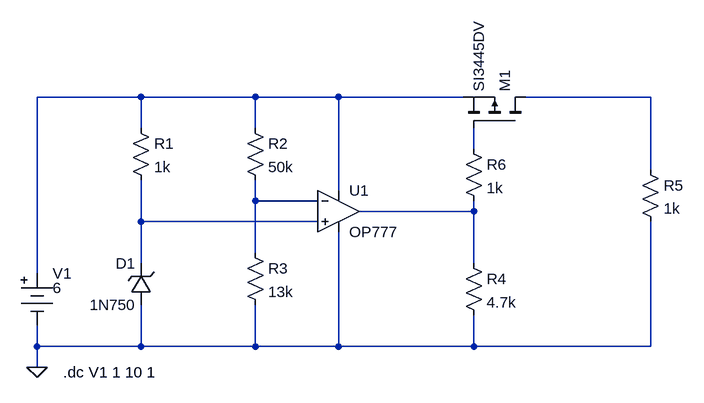
[diagram p0: schematic uvlo.asc]
uvlo.asc, the LTspice schematic file:
Version 4
SHEET 1 1220 680
WIRE 384 80 224 80
WIRE 560 80 384 80
WIRE 688 80 560 80
WIRE 880 80 688 80
WIRE 1168 80 976 80
WIRE 384 128 384 80
WIRE 560 128 560 80
WIRE 896 160 896 128
WIRE 1168 192 1168 80
WIRE 688 224 688 80
WIRE 560 240 560 208
WIRE 656 240 560 240
WIRE 896 256 896 240
WIRE 896 256 720 256
WIRE 384 272 384 208
WIRE 656 272 384 272
WIRE 560 320 560 240
WIRE 384 336 384 272
WIRE 896 336 896 256
WIRE 224 352 224 80
WIRE 224 464 224 432
WIRE 384 464 384 400
WIRE 384 464 224 464
WIRE 560 464 560 400
WIRE 560 464 384 464
WIRE 688 464 688 288
WIRE 688 464 560 464
WIRE 896 464 896 416
WIRE 896 464 688 464
WIRE 1168 464 1168 272
WIRE 1168 464 896 464
WIRE 224 496 224 464
FLAG 224 496 0
SYMBOL Misc/battery 224 336 R0
WINDOW 3 24 38 Left 2
SYMATTR InstName V1
SYMATTR Value 6
SYMBOL res 368 112 R0
SYMATTR InstName R1
SYMATTR Value 1k
SYMBOL res 544 112 R0
SYMATTR InstName R2
SYMATTR Value 50k
SYMBOL res 544 304 R0
SYMATTR InstName R3
SYMATTR Value 13k
SYMBOL zener 400 400 R180
WINDOW 0 24 64 Left 2
WINDOW 3 24 0 Left 2
SYMATTR InstName D1
SYMATTR Value 1N750
SYMBOL res 880 320 R0
SYMATTR InstName R4
SYMATTR Value 4.7k
SYMBOL res 1152 176 R0
SYMATTR InstName R5
SYMATTR Value 1k
SYMBOL res 880 144 R0
SYMATTR InstName R6
SYMATTR Value 1k
SYMBOL pmos 976 128 M270
SYMATTR InstName M1
SYMATTR Value SI3445DV
SYMBOL OpAmps/OP777 688 192 R0
SYMATTR InstName U1
TEXT 264 504 Left 2 !.dc V1 1 10 1

The netlist it stands for:
* uvlo.asc
V1 N001 0 6
R1 N001 N006 1k
R2 N001 N004 50k
R3 N004 0 13k
D1 0 N006 1N750
R4 N005 0 4.7k
R5 N002 0 1k
R6 N003 N005 1k
M1 N002 N003 N001 N001 SI3445DV
XU1 N006 N004 N001 0 N005 OP777  ; pins In+ In- V+ V- OUT
.model D D
.lib standard.dio
.model NMOS NMOS
.model PMOS PMOS
.lib standard.mos
.dc V1 1 10 1
.lib ADI.lib
.backanno
.end